# EAGLE design EFM_VCF6c (EAGLE 7.1.0)
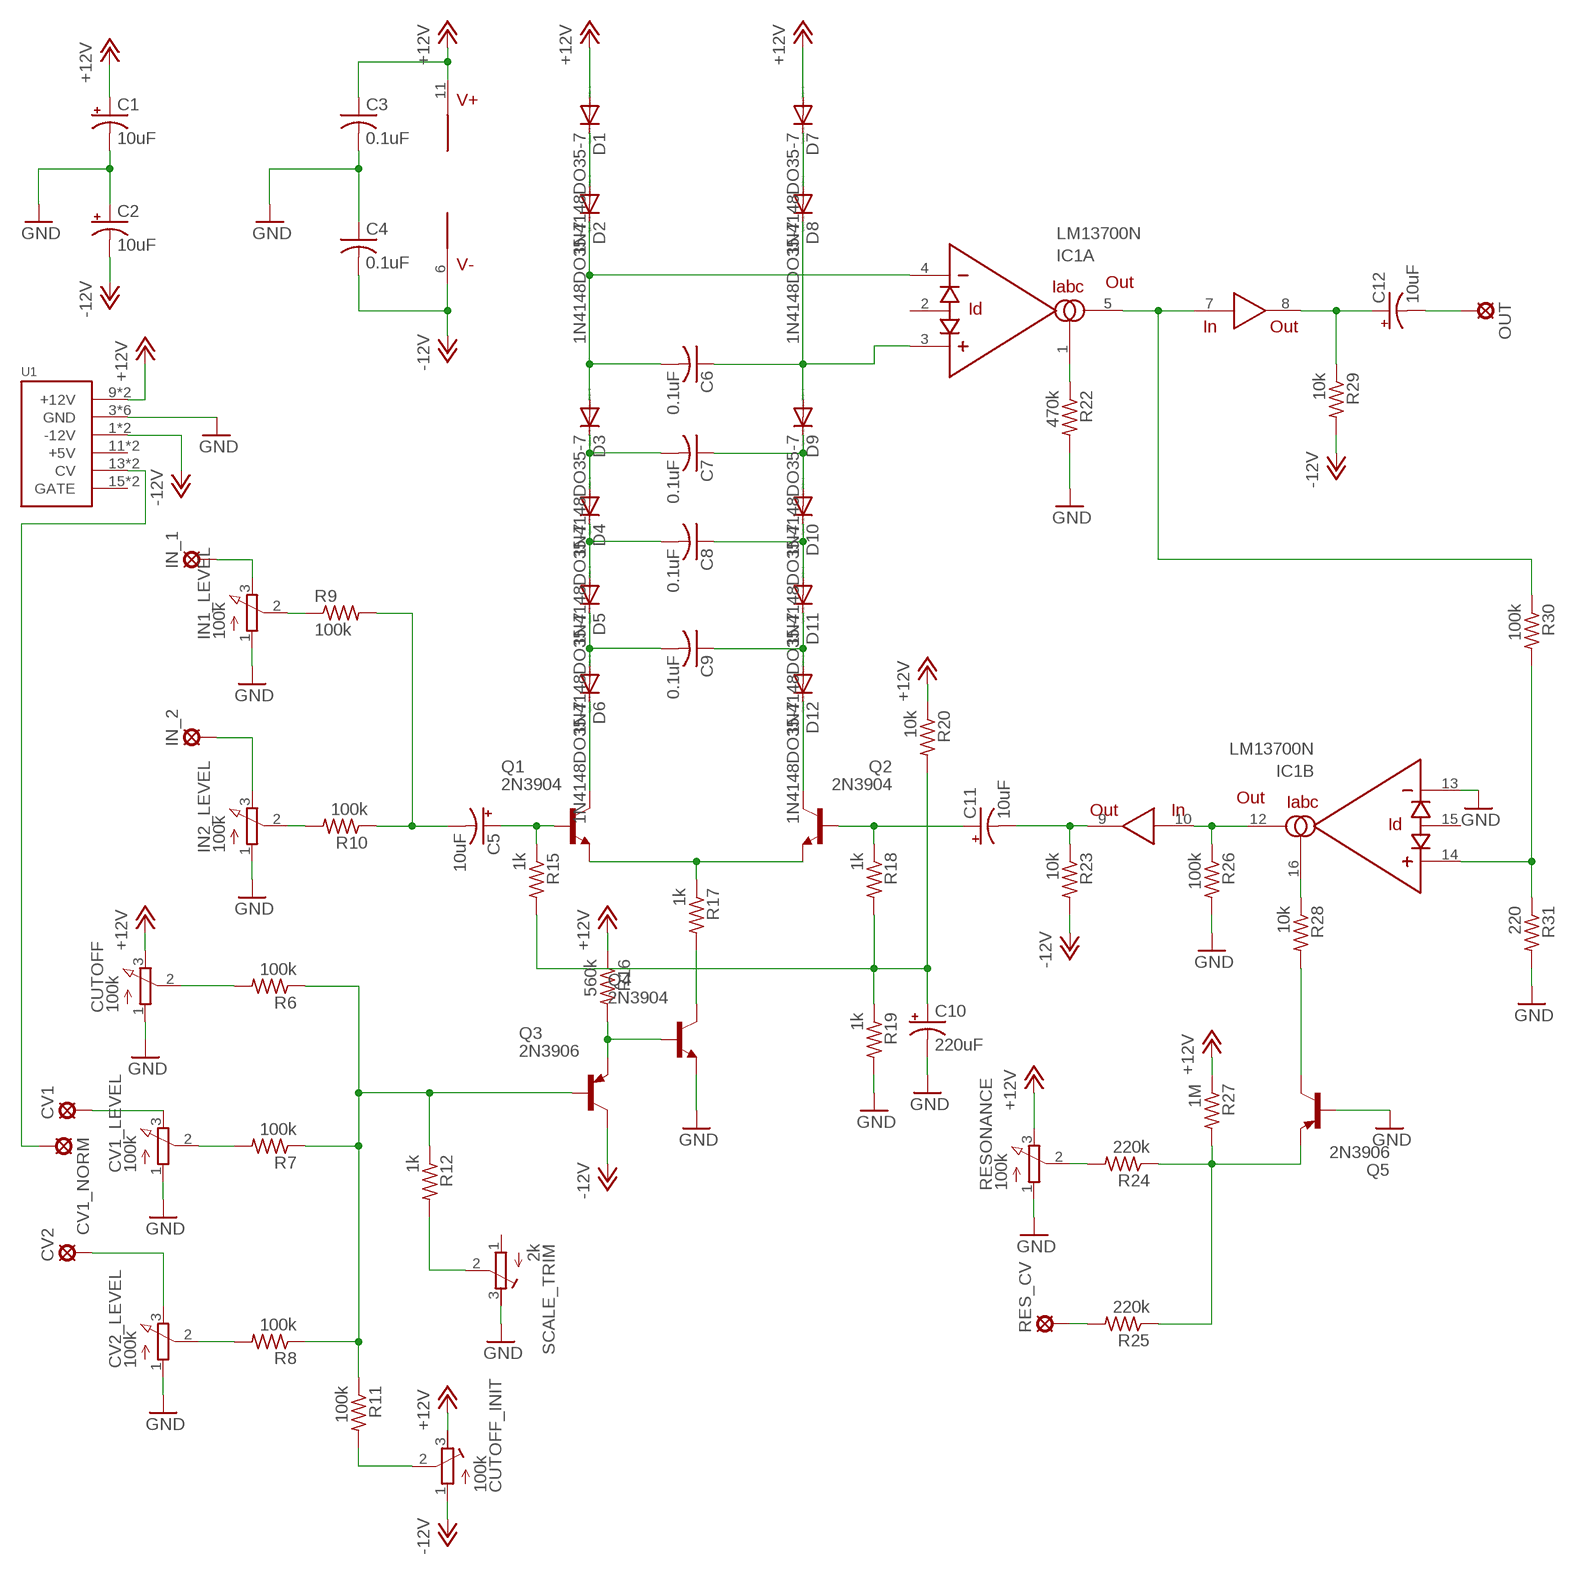
[diagram p0: schematic, sheet 1]

## Parts
C1  10uF  CPOL-USB45181A  [B45181A]
C2  10uF  CPOL-USB45181A  [B45181A]
C3  0.1uF  C-US025-030X050  [C025-030X050]
C4  0.1uF  C-US025-030X050  [C025-030X050]
C5  10uF  CPOL-USB45181A  [B45181A]
C6  0.1uF  C-US025-030X050  [C025-030X050]
C7  0.1uF  C-US025-030X050  [C025-030X050]
C8  0.1uF  C-US025-030X050  [C025-030X050]
C9  0.1uF  C-US025-030X050  [C025-030X050]
C10  220uF  CPOL-USB45181A  [B45181A]
C11  10uF  CPOL-USB45181A  [B45181A]
C12  10uF  CPOL-USB45181A  [B45181A]
CUTOFF  100k  3RP/1610N  [3RP/1610N]
CUTOFF_INIT  100k  R-TRIMM64W  [RTRIM64W]
CV1  LSP10  [LSP10]
CV1_LEVEL  100k  3RP/1610N  [3RP/1610N]
CV1_NORM  LSP10  [LSP10]
CV2  LSP10  [LSP10]
CV2_LEVEL  100k  3RP/1610N  [3RP/1610N]
D1  1N4148DO35-7  [DO35-7]
D2  1N4148DO35-7  [DO35-7]
D3  1N4148DO35-7  [DO35-7]
D4  1N4148DO35-7  [DO35-7]
D5  1N4148DO35-7  [DO35-7]
D6  1N4148DO35-7  [DO35-7]
D7  1N4148DO35-7  [DO35-7]
D8  1N4148DO35-7  [DO35-7]
D9  1N4148DO35-7  [DO35-7]
D10  1N4148DO35-7  [DO35-7]
D11  1N4148DO35-7  [DO35-7]
D12  1N4148DO35-7  [DO35-7]
IC1  LM13700N  [DIL16]
IN1_LEVEL  100k  3RP/1610N  [3RP/1610N]
IN2_LEVEL  100k  3RP/1610N  [3RP/1610N]
IN_1  LSP10  [LSP10]
IN_2  LSP10  [LSP10]
OUT  LSP10  [LSP10]
Q1  2N3904  [TO92]
Q2  2N3904  [TO92]
Q3  2N3906  [TO92]
Q4  2N3904  [TO92]
Q5  2N3906  [TO92]
R6  100k  R-US_0207/7  [0207/7]
R7  100k  R-US_0207/7  [0207/7]
R8  100k  R-US_0207/7  [0207/7]
R9  100k  R-US_0207/7  [0207/7]
R10  100k  R-US_0207/7  [0207/7]
R11  100k  R-US_0207/7  [0207/7]
R12  1k  R-US_0207/7  [0207/7]
R15  1k  R-US_0207/7  [0207/7]
R16  560k  R-US_0207/7  [0207/7]
R17  1k  R-US_0207/7  [0207/7]
R18  1k  R-US_0207/7  [0207/7]
R19  1k  R-US_0207/7  [0207/7]
R20  10k  R-US_0207/7  [0207/7]
R22  470k  R-US_0207/7  [0207/7]
R23  10k  R-US_0207/7  [0207/7]
R24  220k  R-US_0207/7  [0207/7]
R25  220k  R-US_0207/7  [0207/7]
R26  100k  R-US_0207/7  [0207/7]
R27  1M  R-US_0207/7  [0207/7]
R28  10k  R-US_0207/7  [0207/7]
R29  10k  R-US_0207/7  [0207/7]
R30  100k  R-US_0207/7  [0207/7]
R31  220  R-US_0207/7  [0207/7]
RES_CV  LSP10  [LSP10]
RESONANCE  100k  3RP/1610N  [3RP/1610N]
SCALE_TRIM  2k  R-TRIMM64W  [RTRIM64W]
U1  POWER  [POWER_16]

## Nets
-12V: C2.- C4.2 CUTOFF_INIT.1(A) IC1.6(V-) Q3.1(C) R23.2 R29.2 U1.1(-12V) U1.2(-12V)
GND: C1.- C2.+ C3.2 C4.1 C10.- CUTOFF.1(A) CV1_LEVEL.1(A) CV2_LEVEL.1(A) IC1.13(B:-IN) IN1_LEVEL.1(A) IN2_LEVEL.1(A) Q4.3(E) Q5.2(B) R19.2 R22.2 R26.2 R31.2 RESONANCE.1(A) SCALE_TRIM.3(E) U1.3(GND) U1.4(GND) U1.5(GND) U1.6(GND) U1.7(GND) U1.8(GND)
N$1: IC1.1(A:IABC) R22.1
N$2: R25.2 RES_CV.MP
N$3: Q4.1(C) R17.2
N$4: Q1.3(E) Q2.3(E) R17.1
N$5: IN2_LEVEL.2(S) R10.2
N$6: C5.- R9.2 R10.1
N$7: C5.+ Q1.2(B) R15.1
N$8: Q3.3(E) Q4.2(B) R16.2
N$9: C6.2 D2.C D3.A IC1.4(A:-IN)
N$10: CV2_LEVEL.2(S) R8.2
N$11: IC1.5(A:OUT) IC1.7(IN) R30.1
N$12: C6.1 D8.C D9.A IC1.3(A:+IN)
N$13: C7.1 D9.C D10.A
N$14: C8.2 D4.C D5.A
N$15: C8.1 D10.C D11.A
N$16: Q3.2(B) R6.1 R7.1 R8.1 R11.1 R12.1
N$17: C9.1 D11.C D12.A
N$18: C9.2 D5.C D6.A
N$19: D6.C Q1.1(C)
N$20: D12.C Q2.1(C)
N$21: D1.C D2.A
N$22: D7.C D8.A
N$23: R24.2 RESONANCE.2(S)
N$24: Q5.3(E) R24.1 R25.1 R27.2
N$25: C10.+ R15.2 R18.2 R19.1 R20.2
N$26: C11.+ Q2.2(B) R18.1
N$27: CUTOFF_INIT.2(S) R11.2
N$28: C12.+ IC1.8(OUT) R29.1
N$29: C7.2 D3.C D4.A
N$30: IC1.14(B:+IN) R30.2 R31.1
N$31: C12.- OUT.MP
N$32: IC1.16(B:IABC) R28.1
N$33: Q5.1(C) R28.2
N$34: IN2_LEVEL.3(E) IN_2.MP
N$35: C11.- IC1.9(OUT) R23.1
N$36: IC1.10(IN) IC1.12(B:OUT) R26.1
N$37: R12.2 SCALE_TRIM.2(S)
N$38: C1.+ C3.1 CUTOFF.3(E) CUTOFF_INIT.3(E) D1.A D7.A IC1.11(V+) R16.1 R20.1 R27.1 RESONANCE.3(E) U1.9(+12V) U1.10(+12V) ; supply symbol labelled +12V
N$53: CV1_LEVEL.2(S) R7.2
N$54: CV2.MP CV2_LEVEL.3(E)
N$55: CV1_NORM.MP U1.13(CV) U1.14(CV)
N$56: CUTOFF.2(S) R6.2
N$57: IN1_LEVEL.2(S) R9.1
N$58: IN1_LEVEL.3(E) IN_1.MP
N$59: CV1.MP CV1_LEVEL.3(E)
Unconnected: IC1.2(A:ID) IC1.15(B:ID) SCALE_TRIM.1(A) U1.11(+5V) U1.12(+5V) U1.15(GATE) U1.16(GATE)

## Library data of the parts
C1 C2 C5 C10-C12 = rcl:CPOL-US: POLARIZED CAPACITOR, American symbol
C3 C4 C6-C9 = rcl:C-US: CAPACITOR, American symbol
CUTOFF CV1_LEVEL CV2_LEVEL IN1_LEVEL IN2_LEVEL RESONANCE = pot:3RP/1610N: 16mm Potentiometer one level Source: http://www.alphapotentiometers.net/html/16mm_pot_2.html
CUTOFF_INIT SCALE_TRIM = rcl:R-TRIMM: Trimm resistor
CV1 CV1_NORM CV2 IN_1 IN_2 OUT RES_CV = solpad:LSP10: SOLDER PAD drill 1.0 mm, distributor Buerklin, 12H555
D1-D12 = diode:1N4148: DIODE high speed (Philips)
IC1 = synthdiy updated imperial:LM13700: National Dual OTA with buffers.
Q1 Q2 Q4 = transistor-npn:2N3904: NPN Transistor
Q3 Q5 = transistor-pnp:2N3906: PNP Transistor
R6-R12 R15-R20 R22-R31 = rcl:R-US_: RESISTOR, American symbol
U1 = eurorack:POWER

## Board
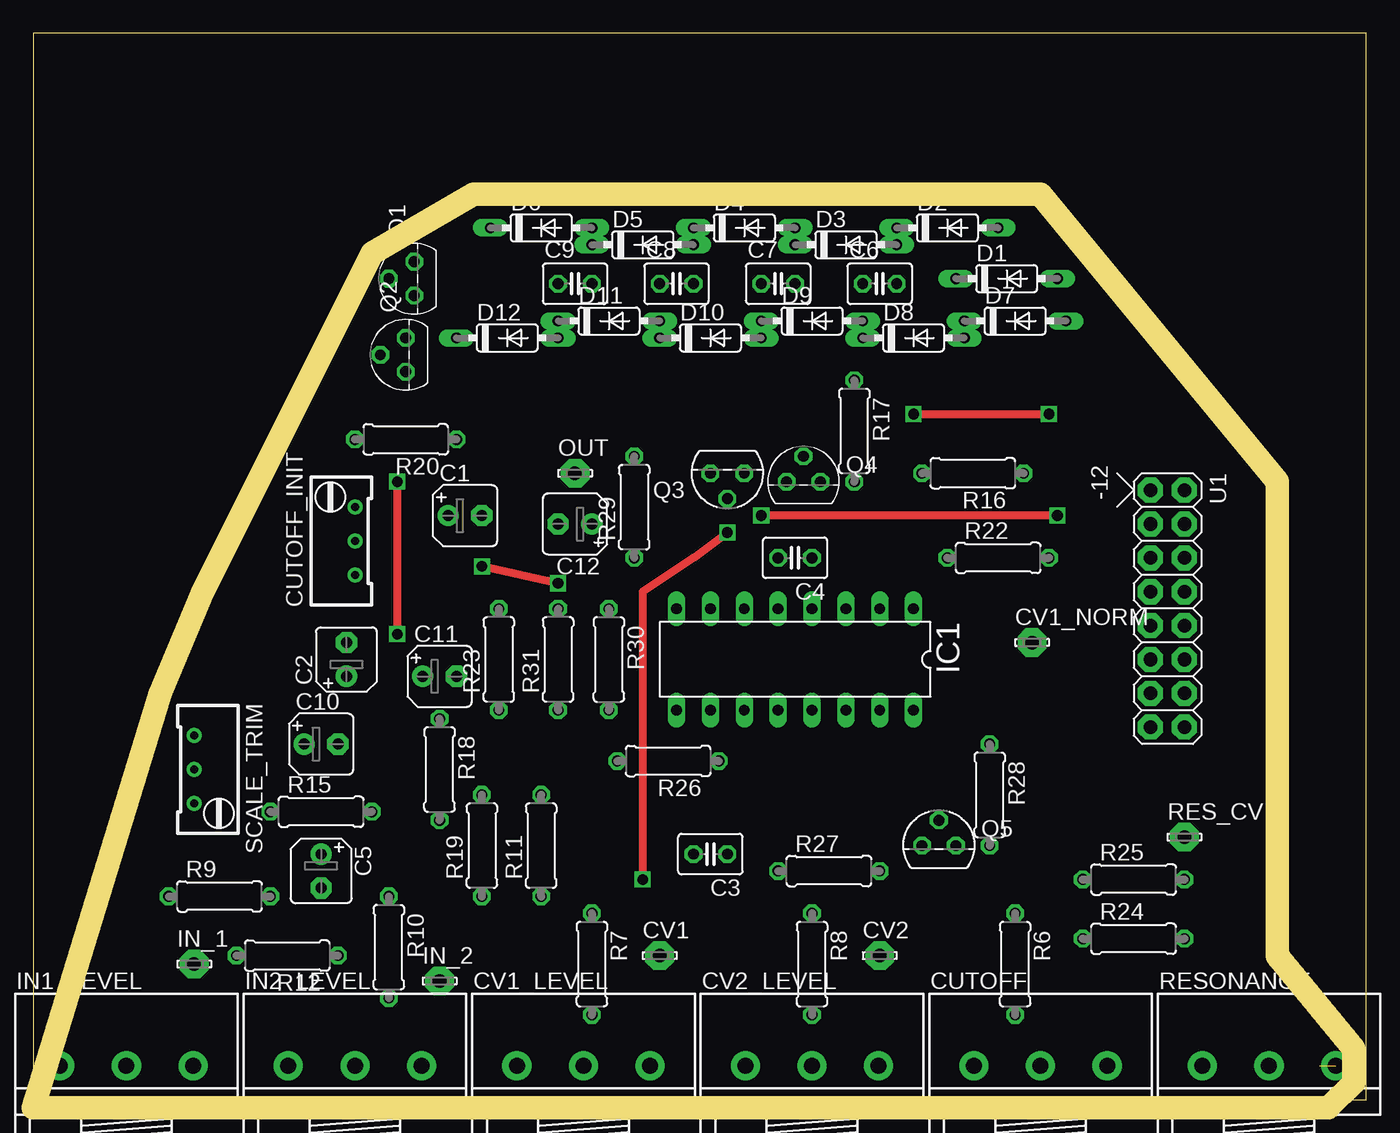
[diagram p1: board, top side]
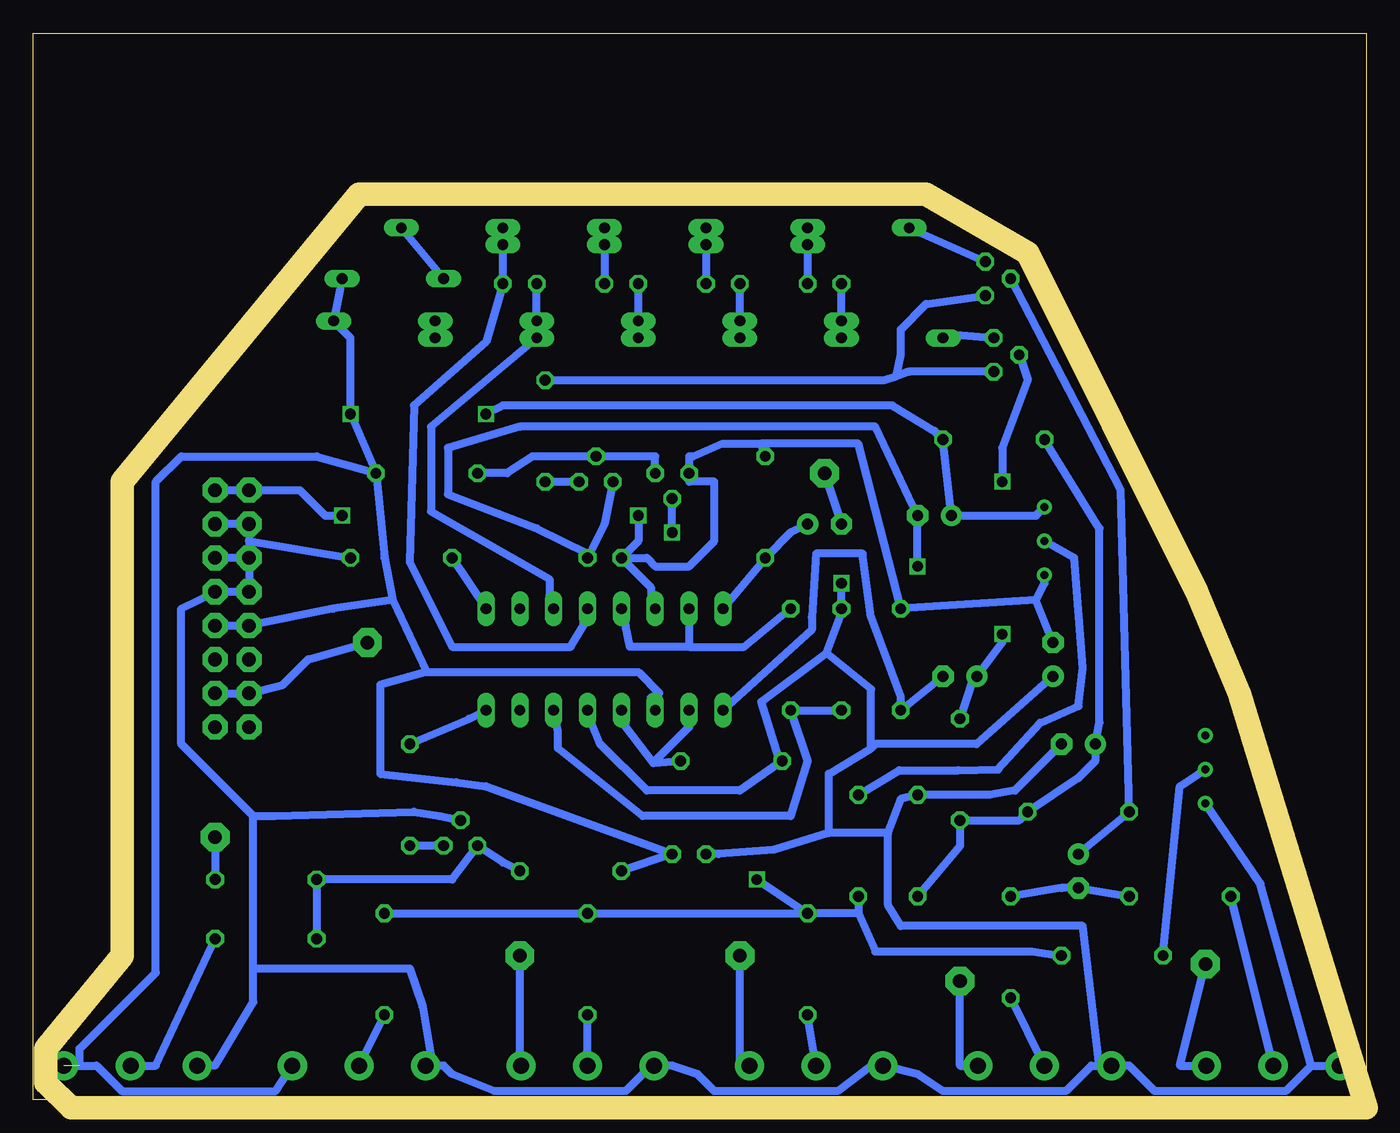
[diagram p2: board, bottom side, seen from below]

Size 100 x 80 mm. Coordinates in mm from the lower left corner, seen from the top.
Outline: 0,0 100,0 100,80 0,80 0,0
Copper layers (1*16): Top 0.035mm / dielectric 1.5mm / Bottom 0.035mm
Design rules "default *": minimum track width 24mil, minimum drill 24mil, track to track 16mil, track to pad 16mil, pad to pad 16mil, via to via 16mil, smd to smd 8mil, copper to edge 0mil, drill to drill 8mil, minimum pad ring 10mil, minimum via ring 8mil, stop-mask expansion 4mil, vias tented up to drill 0mil, thermal gap 10mil
Milling: 11 lines

### Footprints (pad centres in the part's own frame; a part is rotated, then mirrored left to right if it is on the bottom)
B45181A = drill 0.813 pad 1.6: + -1.27,0 | drill 0.813 pad 1.6 octagon: - 1.27,0
C025-030X050 = drill 0.813 octagon: 1 -1.27,0; 2 1.27,0
3RP/1610N = drill 1.2 pad 2.184: 1 -5,0; 2 0,0; 3 5,0
RTRIM64W = drill 0.61: 1 1.27,-2.54; 2 1.27,0; 3 1.27,2.54
LSP10 = drill 1.016 pad 2.159 octagon: MP 0,0
DO35-7 = drill 0.813 long: A 3.81,0; C -3.81,0
DIL16 = drill 0.813 long: 1 -8.89,-3.81; 2 -6.35,-3.81; 3 -3.81,-3.81; 4 -1.27,-3.81; 5 1.27,-3.81; 6 3.81,-3.81; 7 6.35,-3.81; 8 8.89,-3.81; 9 8.89,3.81; 10 6.35,3.81; 11 3.81,3.81; 12 1.27,3.81; 13 -1.27,3.81; 14 -3.81,3.81; 15 -6.35,3.81; 16 -8.89,3.81
TO92 = drill 0.813 octagon: 1 1.27,0; 2 0,1.905; 3 -1.27,0
0207/7 = drill 0.813 octagon: 1 -3.81,0; 2 3.81,0
POWER_16 = drill 1.016 pad 1.88 octagon: 1 -6.35,-1.27; 2 -6.35,1.27; 3 -3.81,-1.27; 4 -3.81,1.27; 5 -1.27,-1.27; 6 -1.27,1.27; 7 1.27,-1.27; 8 1.27,1.27; 9 3.81,-1.27; 10 3.81,1.27; 11 6.35,-1.27; 12 6.35,1.27; 13 8.89,-1.27; 14 8.89,1.27; 15 11.43,-1.27; 16 11.43,1.27

### Placement (x,y rotation side)
C1  32.38,43.81 0 top
C2  23.5,33.02 90 top
C3  50.8,18.41 180 top
C4  57.15,40.64 180 top
C5  21.59,17.14 270 top
C6  63.5,61.21 0 top
C7  55.88,61.21 0 top
C8  48.26,61.21 0 top
C9  40.64,61.21 0 top
C10  21.59,26.67 0 top
C11  30.48,31.75 0 top
C12  40.64,43.18 180 top
CUTOFF  75.56,2.54 0 top
CUTOFF_INIT  22.86,41.91 0 top
CV1  46.99,10.79 0 top
CV1_LEVEL  41.27,2.54 0 top
CV1_NORM  74.93,34.29 0 top
CV2  63.5,10.79 0 top
CV2_LEVEL  58.42,2.54 0 top
D1  73.03,61.59 0 top
D2  68.58,65.41 0 top
D3  60.96,64.14 0 top
D4  53.34,65.41 0 top
D5  45.72,64.14 0 top
D6  38.1,65.41 0 top
D7  73.66,58.42 0 top
D8  66.04,57.15 0 top
D9  58.42,58.42 0 top
D10  50.8,57.15 0 top
D11  43.18,58.42 0 top
D12  35.56,57.15 0 top
IC1  57.15,33.02 180 top
IN1_LEVEL  6.99,2.54 0 top
IN2_LEVEL  24.13,2.54 0 top
IN_1  12.06,10.16 0 top
IN_2  30.48,8.89 0 top
OUT  40.64,46.99 0 top
Q1  28.57,61.59 90 top
Q2  27.94,55.88 90 top
Q3  52.07,46.99 180 top
Q4  57.78,46.35 0 top
Q5  67.94,19.05 0 top
R6  73.66,10.16 270 top
R7  41.91,10.16 270 top
R8  58.42,10.16 270 top
R9  13.97,15.24 0 top
R10  26.67,11.43 270 top
R11  38.1,19.05 90 top
R12  19.05,10.79 180 top
R15  21.59,21.59 0 top
R16  70.48,46.99 180 top
R17  61.59,50.16 270 top
R18  30.48,24.77 270 top
R19  33.66,19.05 90 top
R20  27.94,49.53 180 top
R22  72.39,40.64 0 top
R23  34.92,33.02 90 top
R24  82.55,12.06 0 top
R25  82.55,16.51 0 top
R26  47.62,25.4 180 top
R27  59.69,17.14 0 top
R28  71.75,22.86 270 top
R29  45.09,44.45 90 top
R30  43.18,33.02 270 top
R31  39.37,33.02 90 top
RES_CV  86.36,19.68 0 top
RESONANCE  92.71,2.54 0 top
SCALE_TRIM  13.34,24.77 180 top
U1  85.09,39.37 270 top

### Tracks (layer width: path | path; a pad name or v marks a point on that pad's centre or on a via)
-12V  (via drill 0.8)
  Top 0.61: v76.83,43.81 v54.61,43.81
  Bottom 0.61: IC1.6 53.66,37.15 53.66,38.42 C4.2 | CUTOFF_INIT.1 24.13,38.73 24.77,37.47 | C2.- 24.77,37.47 | 24.77,37.47 R23.2 38.1,49.21 45.4,49.21 | U1.2 U1.1 80.01,45.72 78.11,43.81 v76.83,43.81 | C4.2 53.98,40.64 53.34,40.01 50.8,40.01 48.9,41.91 48.9,46.35 50.8,46.35 Q3.1 50.8,48.26 50.48,48.26 48.26,49.21 45.4,49.21 | 45.4,49.21 R29.2 | v54.61,43.81 54.61,41.91 C4.2
GND  (via drill 0.8)
  Top 0.61: v39.37,38.73 v33.66,40.01
  Bottom 0.61: U1.5 U1.7 U1.8 88.9,36.83 88.9,26.67 83.5,21.27 | U1.5 U1.6 | 83.82,41.91 R22.2 | 83.82,41.91 U1.3 U1.4 | 83.82,41.91 U1.5 | Q5.2 69.53,21.27 71.44,21.59 81.92,21.27 83.5,21.27 | 83.5,9.84 83.5,7.3 86.36,2.54 RESONANCE.1 | 83.5,9.84 83.5,21.27 | 83.5,9.84 71.75,9.84 70.8,6.99 70.17,3.17 70.17,2.54 CUTOFF.1 69.22,2.54 68.58,1.91 65.41,0.64 55.56,0.64 53.66,2.54 CV2_LEVEL.1 52.07,2.54 50.16,1.91 48.9,0.64 39.69,0.64 37.15,2.54 CV1_LEVEL.1 36.2,2.54 33.66,1.91 31.75,0.64 22.54,0.64 20.64,2.54 IN2_LEVEL.1 | Q4.3 57.15,43.18 C4.1 58.42,40.96 62.23,42.86 68.9,45.4 68.9,48.9 63.5,50.48 36.83,50.48 C1.- v33.66,40.01 | 40.48,33.5 39.37,36.51 R31.2 v39.37,38.73 | 40.48,33.5 45.4,29.84 44.13,25.72 R26.2 46.99,23.18 53.98,23.18 57.47,26.67 58.1,28.26 IC1.13 | C10.- 26.35,23.18 28.26,22.86 R19.2 34.92,22.54 35.88,20 | C3.2 48.58,18.41 44.45,18.73 40.32,20 | 35.88,20 40.32,20 | 40.48,33.5 37.15,30.8 37.15,26.35 | 37.15,26.35 40.32,24.45 40.32,20 | SCALE_TRIM.3 7.94,16.19 4.13,2.54 | IN2_LEVEL.1 17.78,2.54 15.88,0.64 6.03,0.64 4.13,2.54 | IN2_LEVEL.1 20,2.54 21.27,13.02 34.92,13.02 35.88,14.61 35.88,20 | 4.13,2.54 IN1_LEVEL.1 | C2.+ 29.21,26.67 36.83,26.67 37.15,26.35
N$1
  Bottom 0.61: R22.1 IC1.1
N$2
  Bottom 0.61: RES_CV.MP R25.2
N$3
  Bottom 0.61: R17.2 Q4.1
N$4
  Bottom 0.61: Q2.3 34.29,54.61 35.24,54.29 | 35.24,54.29 34.92,55.88 34.92,57.78 33.02,59.69 Q1.3 | 35.24,54.29 36.2,53.98 R17.1
N$5
  Bottom 0.61: IN2_LEVEL.2 R10.2
N$6
  Bottom 0.61: R10.1 22.86,15.88 C5.- R9.2
N$7
  Bottom 0.61: C5.+ R15.1 18.41,45.72 Q1.2
N$8
  Bottom 0.61: R16.2 64.45,46.99 62.55,48.26 Q4.2 53.34,48.26 Q3.3
N$9
  Bottom 0.61: D2.C D3.A C6.2 66.04,56.83 71.44,52.07 71.75,40.32 68.58,33.97 59.69,33.97 58.74,35.56 58.74,36.51 IC1.4
N$10
  Bottom 0.61: CV2_LEVEL.2 R8.2
N$11
  Bottom 0.61: R30.1 46.67,33.97 50.8,33.97 | IC1.7 50.8,33.97 | IC1.5 55.56,35.88 55.56,35.56 55.24,33.97 50.8,33.97
N$12
  Bottom 0.61: IC1.3 61.28,37.78 61.28,39.05 70.17,44.13 70.17,50.48 D8.C D9.A C6.1
N$13
  Bottom 0.61: D10.A D9.C C7.1
N$14
  Bottom 0.61: C8.2 D5.A D4.C
N$15
  Bottom 0.61: D10.C D11.A C8.1
N$16  (via drill 0.8)
  Top 0.61: v52.07,42.55 49.53,40.64 45.72,38.1 v45.72,16.51
  Bottom 0.61: R6.1 R8.1 R7.1 | R12.1 25.08,11.11 36.83,11.11 38.1,13.97 | R11.1 38.1,13.97 | 38.1,13.97 R7.1 | v45.72,16.51 R7.1 | v52.07,42.55 Q3.2
N$17
  Bottom 0.61: D12.A D11.C C9.1
N$18
  Bottom 0.61: C9.2 D5.C D6.A
N$19
  Bottom 0.61: D6.C Q1.1
N$20
  Bottom 0.61: Q2.1 27.62,57.15 31.75,57.47 D12.C
N$21
  Bottom 0.61: D2.A D1.C
N$22
  Bottom 0.61: D7.C D8.A
N$23
  Bottom 0.61: R24.2 90.81,2.54 RESONANCE.2
N$24
  Bottom 0.61: R27.2 64.77,17.78 Q5.3 68.58,16.51 R25.1 R24.1
N$25
  Bottom 0.61: R19.1 30.48,19.05 R18.2 26.04,20.95 R15.2 21.59,24.13 20.32,25.4 C10.+ 20,28.26 20,42.86 R20.2
N$26  (via drill 0.8)
  Top 0.61: v27.3,46.35 v27.3,34.92
  Bottom 0.61: R18.1 29.53,31.43 C11.+ 27.3,34.29 v27.3,34.92 | Q2.2 25.4,53.98 27.3,48.9 v27.3,46.35
N$27
  Bottom 0.61: CUTOFF_INIT.2 21.91,40.64 21.27,32.38 21.59,29.53 24.45,28.26 27.62,24.77 30.61,24.7 35.05,24.7 R11.2
N$28
  Bottom 0.61: C12.+ 43.18,42.55 R29.1 IC1.8
N$29
  Bottom 0.61: C7.2 D3.C D4.A
N$30
  Bottom 0.61: R31.1 R30.2 41.91,25.4 43.18,21.27 54.29,21.27 60.64,26.35 60.64,27.62 IC1.14
N$31
  Bottom 0.61: OUT.MP C12.-
N$32
  Bottom 0.61: IC1.16 67.31,28.57 R28.1
N$33
  Bottom 0.61: Q5.1 R28.2
N$34
  Bottom 0.61: IN_2.MP 30.48,2.54 IN2_LEVEL.3
N$35
  Bottom 0.61: C11.- R23.1 34.92,30.16 37.15,36.2 37.78,40.96 41.27,40.96 41.59,36.2 41.59,35.24 IC1.9
N$36
  Bottom 0.61: 53.5,25.24 50.8,27.94 IC1.10 | 53.5,25.24 R26.1 | IC1.12 55.56,28.26 55.56,27.94 53.5,25.24
N$37
  Bottom 0.61: SCALE_TRIM.2 13.97,23.5 R12.2
N$38  (via drill 0.8)  (1 unrouted)
  Top 0.61: v66.04,51.44 v76.2,51.44
  Bottom 0.61: 96.52,2.54 96.52,3.81 90.81,9.53 90.81,46.35 88.9,48.26 78.74,48.26 R16.1 | D1.A D7.A 76.2,57.15 v76.2,51.44 R16.1 | U1.10 U1.9 77.47,36.83 73.03,37.47 | R27.1 C3.1 66.04,23.5 68.26,23.81 73.98,24.45 73.98,31.11 70.48,32.07 | IC1.11 53.66,30.16 53.02,30.48 54.61,32.07 70.48,32.07 | 73.03,37.47 73.66,40.64 R16.1 | 73.03,37.47 70.48,32.07 | CUTOFF_INIT.3 24.77,43.81 C1.+ R20.1 32.38,50.16 35.56,52.07 64.77,52.07 v66.04,51.44 | RESONANCE.3 95.25,2.54 93.34,0.64 81.83,0.64 CUTOFF.3
N$53
  Bottom 0.61: CV1_LEVEL.2 R7.2
N$54
  Bottom 0.61: CV2.MP 63.5,2.54 CV2_LEVEL.3
N$55
  Bottom 0.61: U1.14 U1.13 81.28,31.11 79.38,33.02 CV1_NORM.MP
N$56
  Bottom 0.61: CUTOFF.2 R6.2
N$57
  Bottom 0.61: IN1_LEVEL.2 R9.1
N$58
  Bottom 0.61: IN_1.MP 13.97,2.54 IN1_LEVEL.3
N$59
  Bottom 0.61: CV1.MP 46.99,2.54 CV1_LEVEL.3